# Altium schematic sheet Power_supply_BA50DD0WHFPCT.SchDoc
size A
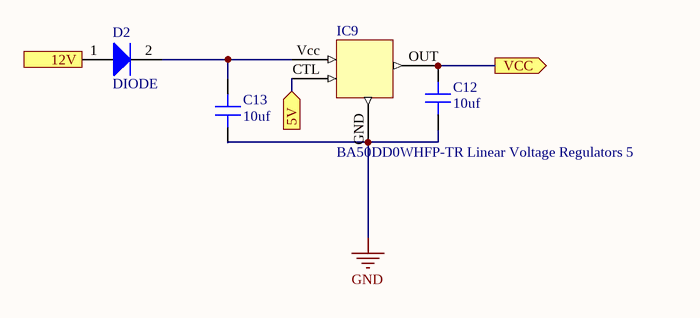
[diagram p0: Power_supply_BA50DD0WHFPCT.SchDoc]

## Parts
C12  value 10uf  [CAP 0603/1608]  (hidden comment: Capacitor MLCC 10uf 16V CAP 0603/1608)
C13  value 10uf  [CAP 0603/1608]  (hidden comment: Capacitor MLCC 10uf 16V CAP 0603/1608)
D2  DIODE  [SODFL350X115-2M]
IC9  BA50DD0WHFP-TR Linear Voltage Regulators 5  [HRP5]

## Ports
5V (in), 12V (in), VCC (out)

## Nets
GND: C12.1 C13.1 IC9.GND
5V: IC9.CTL ; port 5V
12V: D2.1(A) ; port 12V
VCC: C12.2 IC9.OUT ; port VCC
NetC13_2: C13.2 D2.2(K) IC9.Vcc

## Library data of the parts
C12 C13 = 235: Manufacturer_id: 1; idCapacitor: 235; Name: Cap_10uf_16V_CAP 0603/1608; Dielectric: Ceramic; Created_By: Nick Mah; Drawer_id: 1; Voltage_Rating: 16V; Package: CAP 0603/1608; Created_Date: 10/20/2018
D2 = 2: Diode Super Barrier 40V 1A Surface Mount SOD-123F; Manufacturer_id: 1; MfrPartNo: 1N5819HW1-7-F; idDiode: 2; Name: 1N5819; Drawer_id: 1; Value: 1A; Type: Super Barrier; Num_Circuits: 1; Ic: 1A; Power: 40V; Package: SOD-123; Link: https://www.digikey.com/product-detail/en/diodes-incorporated/1N5819HW1-7-F/1N5819HW1-7-FDITR-ND/5768523; ComponentLink1Description: Datasheet; ComponentLink1URL: https://www.diodes.com/assets/Datasheets/1N5819HW1.pdf; Supplier1: Digi-Key; Supplier1PartNo: 1N5819HW1-7-FDITR-ND
IC9 = 6: Manufacturer_id: 1; idPMIC_Lin: 6; Name: BA50DD0WHFP-TR Linear Voltage Regulator 5; Value: 5V; Vin(Min): 3V; Vin(Max): 33V; Current_Rating: 2A; Dropout_Voltage: 0.7V; Drawer_id: 1; Vout(Max): 5V; Link: https://www.mouser.com/ProductDetail/ROHM-Semiconductor/BA50DD0WHFP-TR?qs=4kLU8WoGk0sFpKnESpdNFg%3D%3D